# Altium schematic sheet Copy of Sheet1.SchDoc
size A3
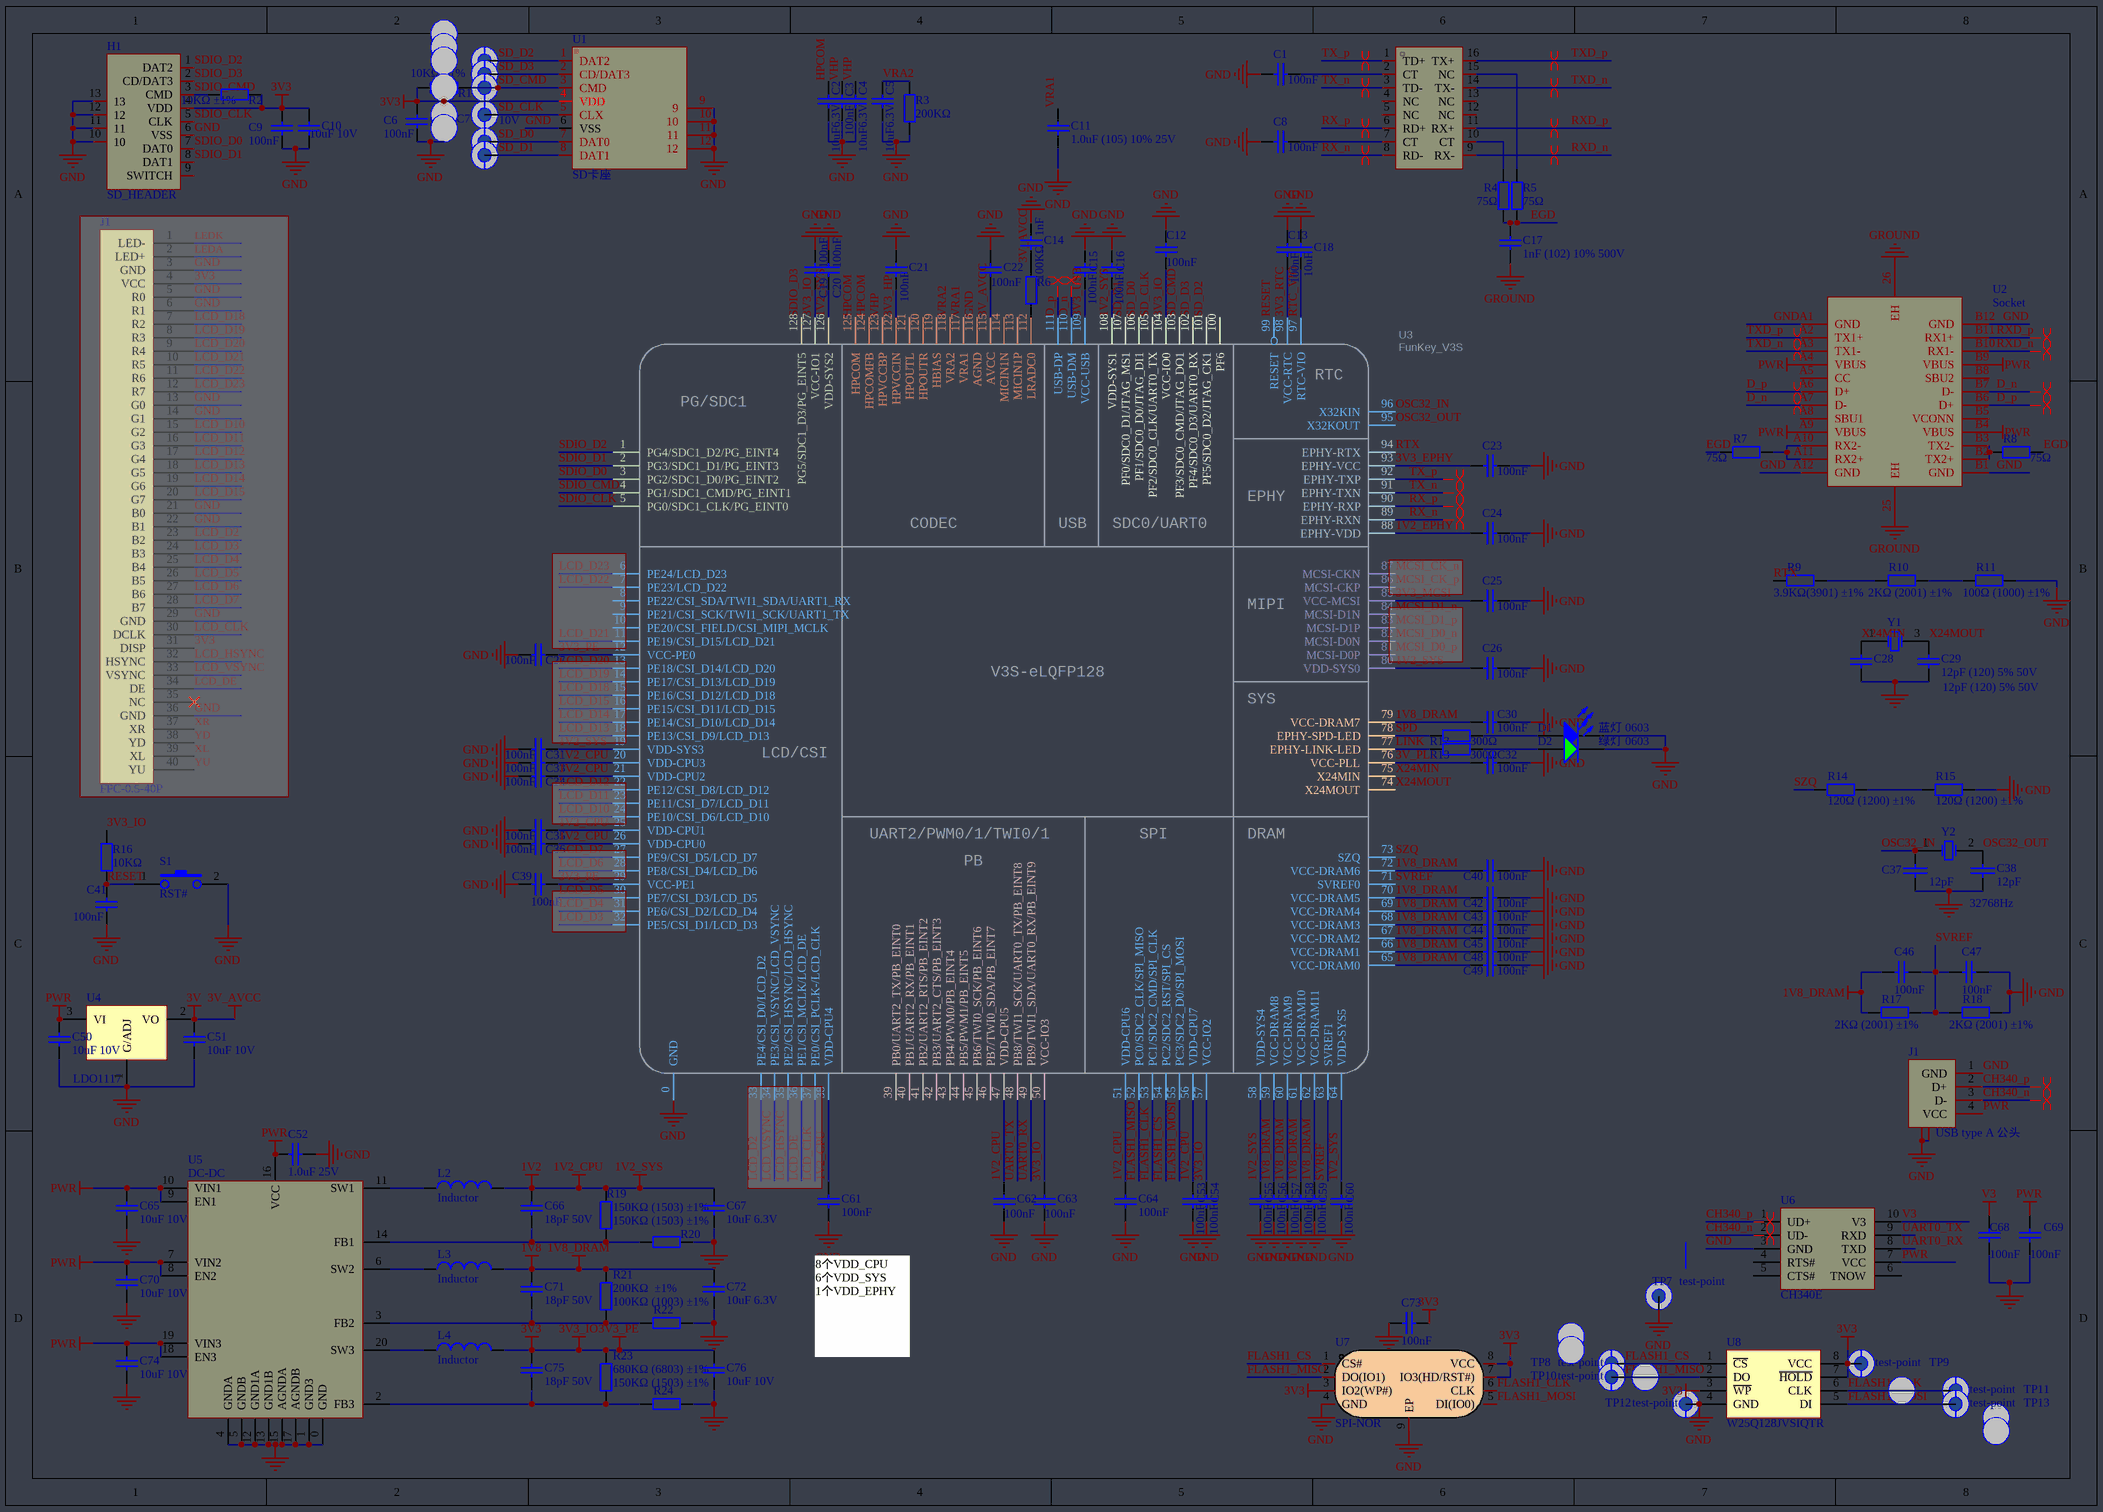
[diagram p0: Copy of Sheet1.SchDoc]

## Parts
(Parts that share a designator on the sheet are numbered #1, #2 ... from top to bottom, then left to right.)
C1  100nF  [0402_C]
C2  10uF6.3V  [0402_C]
C3  100nF  [0402_C]
C4  10uF6.3V  [0402_C]
C5  10uF6.3V  [0402_C]
C6  100nF  [0402_C]
C7  10uF 10V  [0603_C]
C8  100nF  [0402_C]
C9  100nF  [0402_C]
C10  10uF 10V  [0603_C]
C11  1.0uF (105) 10% 25V  [0402_C]
C12  100nF  [0402_C]
C13  100nF  [0402_C]
C14  1nF  [0402_C]
C15  100nF  [0402_C]
C16  100nF  [0402_C]
C17  1nF (102) 10% 500V  [1206_C]
C18  10uF  [0402_C]
C19  100nF  [0402_C]
C20  100nF  [0402_C]
C21  100nF  [0402_C]
C22  100nF  [0402_C]
C23  100nF  [0402_C]
C24  100nF  [0402_C]
C25  100nF  [0402_C]
C26  100nF  [0402_C]
C27  100nF  [0402_C]
C28  12pF (120) 5% 50V  [0402_C]
C29  12pF (120) 5% 50V  [0402_C]
C30  100nF  [0402_C]
C31  100nF  [0402_C]
C32  100nF  [0402_C]
C33  100nF  [0402_C]
C34  100nF  [0402_C]
C35  100nF  [0402_C]
C36  100nF  [0402_C]
C37  12pF  [0402_C]
C38  12pF  [0402_C]
C39  100nF  [0402_C]
C40  100nF  [0402_C]
C41  100nF  [0402_C]
C42  100nF  [0402_C]
C43  100nF  [0402_C]
C44  100nF  [0402_C]
C45  100nF  [0402_C]
C46  100nF  [0402_C]
C47  100nF  [0402_C]
C48  100nF  [0402_C]
C49  100nF  [0402_C]
C50  10uF 10V  [0603_C]
C51  10uF 10V  [0603_C]
C52  1.0uF 25V  [0402_C]
C53  100nF  [0402_C]
C54  100nF  [0402_C]
C55  100nF  [0402_C]
C56  100nF  [0402_C]
C57  100nF  [0402_C]
C58  100nF  [0402_C]
C59  100nF  [0402_C]
C60  100nF  [0402_C]
C61  100nF  [0402_C]
C62  100nF  [0402_C]
C63  100nF  [0402_C]
C64  100nF  [0402_C]
C65  10uF 10V  [0603_C]
C66  18pF 50V  [0402_C]
C67  10uF 6.3V  [0402_C]
C68  100nF  [0402_C]
C69  100nF  [0402_C]
C70  10uF 10V  [0603_C]
C71  18pF 50V  [0402_C]
C72  10uF 6.3V  [0402_C]
C73  100nF  [0402_C]
C74  10uF 10V  [0603_C]
C75  18pF 50V  [0402_C]
C76  10uF 10V  [0603_C]
D1  蓝灯 0603  [0603_LED_S1]
D2  绿灯 0603  [0603_LED_S1]
H1  SD_HEADER  [SD_HEADER]
J1#1  FPC-0.5-40P  [PFC40]  (masked out: inside a compile mask, not in the netlist)
J1#2  USB type A 公头  [USBAM]
L1  B1603S  [SOIC-16_L12.7-W7.1-P1.27-LS9.5-BL]  (value not drawn)
L2  Inductor  [0603_L]
L3  Inductor  [0603_L]
L4  Inductor  [0603_L]
R1  10KΩ ±1%  [0402_R]
R2  10KΩ ±1%  [0402_R]
R3  200KΩ  [0402_R]
R4  75Ω  [0402_R]
R5  75Ω  [0402_R]
R6  100KΩ  [0402_R]
R7  75Ω  [0402_R]
R8  75Ω  [0402_R]
R9  3.9KΩ(3901) ±1%  [0402_R]
R10  2KΩ (2001) ±1%  [0402_R]
R11  100Ω (1000) ±1%  [0402_R]
R12  300Ω  [0402_R]
R13  300Ω  [0402_R]
R14  120Ω (1200) ±1%  [0402_R]
R15  120Ω (1200) ±1%  [0402_R]
R16  10KΩ  [0402_R]
R17  2KΩ (2001) ±1%  [0402_R]
R18  2KΩ (2001) ±1%  [0402_R]
R19  150KΩ (1503) ±1%  [0402_R]
R20  150KΩ (1503) ±1%  [0402_R]
R21  200KΩ  ±1%  [0402_R]
R22  100KΩ (1003) ±1%  [0402_R]
R23  680KΩ (6803) ±1%  [0402_R]
R24  150KΩ (1503) ±1%  [0402_R]
S1  RST#  [SW-3*4-2P]
TP1  test-point  [POINT]  (value not drawn)
TP2  test-point  [POINT]  (value not drawn)
TP3  test-point  [POINT]  (value not drawn)
TP4  test-point  [POINT]  (value not drawn)
TP5  test-point  [POINT]  (value not drawn)
TP6  test-point  [POINT]  (value not drawn)
TP7  test-point  [POINT]
TP8  test-point  [POINT]
TP9  test-point  [POINT]
TP10  test-point  [POINT]
TP11  test-point  [POINT]
TP12  test-point  [POINT]
TP13  test-point  [POINT]
U1  SD卡座  [tf103]
U2  Socket  [USB type C 24 pin]
U3  FunKey_V3S  [ELQFP-128]
U4  LDO1117  [SOT-23-3L]
U5  DC-DC  [QFN20_3X3]
U6  CH340E  [MSOP10]
U7  SPI-NOR  [WSON8]
U8  W25Q128JVSIQTR  [SOIC-8_208mil]
Y1  25MHZ 12PF 10PPM  [SMD-3225_4P]  (value not drawn)
Y2  32768Hz  [3225-2]

## Nets
1V2_CPU: C16.2 C20.2 C26.2 C31.2 C33.2 C34.2 C35.2 C36.2 C53.2 C55.2 C60.2 C61.2 C62.2 C64.2 C66.2 C67.2 L2.2 R19.2 U3.19(VDD-SYS3) U3.20(VDD-CPU3) U3.21(VDD-CPU2) U3.25(VDD-CPU1) U3.26(VDD-CPU0) U3.38(VDD-CPU4) U3.47(VDD-CPU5) U3.51(VDD-CPU6) U3.56(VDD-CPU7) U3.58(VDD-SYS4) U3.64(VDD-SYS5) U3.80(VDD-SYS0) U3.108(VDD-SYS1) U3.126(VDD-SYS2)  [also labelled 1V2, 1V2_SYS]
1V8_DRAM: C30.2 C40.2 C42.2 C43.2 C44.2 C45.2 C46.2 C48.2 C49.2 C56.2 C57.2 C58.2 C59.2 C71.2 C72.2 L3.2 R17.1 R21.2 U3.59(VCC-DRAM8) U3.60(VCC-DRAM9) U3.61(VCC-DRAM10) U3.62(VCC-DRAM11) U3.65(VCC-DRAM0) U3.66(VCC-DRAM1) U3.67(VCC-DRAM2) U3.68(VCC-DRAM3) U3.69(VCC-DRAM4) U3.70(VCC-DRAM5) U3.72(VCC-DRAM6) U3.79(VCC-DRAM7)  [also labelled 1V8]
3V3_IO: C6.2 C7.2 C9.2 C10.2 C12.2 C19.2 C27.2 C39.2 C54.2 C63.2 C73.2 C75.2 C76.2 H1.4(VDD) L4.2 R1.2 R2.1 R16.2 R23.2 TP9.1(point) U1.4(VDD) U3.12(VCC-PE0) U3.29(VCC-PE1) U3.50(VCC-IO3) U3.57(VCC-IO2) U3.104(VCC-IO0) U3.127(VCC-IO1) U7.3(IO2(WP#)) U7.7(IO3(HD/RST#)) U7.8(VCC) U8.3(~{WP}) U8.7(~{HOLD}) U8.8(VCC)  [also labelled 3V3, 3V3_PE]
3V_AVCC: C14.1 C22.2 C51.2 R6.2 U3.115(AVCC) U4.2(VO)  [also labelled 3V]
GND: C1.2 C2.1 C3.2 C4.1 C5.1 C6.1 C7.1 C8.2 C9.1 C10.1 C11.1 C12.1 C13.1 C14.2 C15.1 C16.1 C18.2 C19.1 C20.1 C21.1 C22.1 C23.1 C24.1 C25.1 C26.1 C27.1 C28.1 C29.1 C30.1 C31.1 C32.1 C33.1 C34.1 C35.1 C36.1 C37.1 C38.1 C39.1 C40.1 C41.1 C42.1 C43.1 C44.1 C45.1 C47.1 C48.1 C49.1 C50.1 C51.1 C52.1 C53.1 C54.1 C55.1 C56.1 C57.1 C58.1 C59.1 C60.1 C61.1 C62.1 C63.1 C64.1 C65.1 C67.1 C68.1 C69.1 C70.1 C72.1 C73.1 C74.1 C76.1 D1.K D2.K H1.6(VSS) H1.10 H1.11 H1.12 H1.13 J1#2.1(GND) J1#2.5 J1#2.6 R3.1 R11.2 R15.2 R18.2 R20.1 R22.2 R24.2 S1.2 TP7.1(point) TP12.1(point) U1.6(VSS) U1.9 U1.10 U1.11 U1.12 U2.A1(GND) U2.A12(GND) U2.B1(GND) U2.B12(GND) U3.0(GND) U3.116(AGND) U4.1(G/ADJ) U5.0(GND) U5.1(GND3) U5.4(GNDA) U5.5(GNDB) U5.12(GND1A) U5.13(GND1B) U5.15(AGNDA) U5.17(AGNDB) U6.3(GND) U7.4(GND) U7.9(EP) U8.4(GND)
GROUND: C17.1 U2.25(EH) U2.26(EH)
PWR: C50.2 C52.2 C65.2 C69.2 C70.2 C74.2 J1#2.4(VCC) U2.A4(VBUS) U2.A9(VBUS) U2.B4(VBUS) U2.B9(VBUS) U4.3(VI) U5.7(VIN2) U5.8(EN2) U5.9(EN1) U5.10(VIN1) U5.16(VCC) U5.18(EN3) U5.19(VIN3) U6.7(VCC)
V3: C68.2 U6.10(V3)
1V2_EPHY: C24.2 U3.88(EPHY-VDD)
3V3_EPHY: C23.2 U3.93(EPHY-VCC)
3V3_HP: C21.2 U3.122(HPVCCIN)
3V3_MCSI: C25.2 U3.85(VCC-MCSI)
3V3_RTC: C13.2 U3.98(VCC-RTC)
3V3_USB: C15.2 U3.109(VCC-USB)
3V_PLL: C32.2 U3.76(VCC-PLL)
CH340_n: J1#2.3(D-) U6.2(UD-)
CH340_p: J1#2.2(D+) U6.1(UD+)
D_n: U2.A7(D-) U2.B7(D-) U3.110(USB-DM)
D_p: U2.A6(D+) U2.B6(D+) U3.111(USB-DP)
EGD: C17.2 R4.1 R5.1 R7.2 R8.2
FLASH1_CLK: TP11.1(point) U3.53(PC1/SDC2_CMD/SPI_CLK) U7.6(CLK) U8.6(CLK)
FLASH1_CS: TP8.1(point) U3.54(PC2/SDC2_RST/SPI_CS) U7.1(CS#) U8.1(~{CS})
FLASH1_MISO: TP10.1(point) U3.52(PC0/SDC2_CLK/SPI_MISO) U7.2(DO(IO1)) U8.2(DO)
FLASH1_MOSI: TP13.1(point) U3.55(PC3/SDC2_D0/SPI_MOSI) U7.5(DI(IO0)) U8.5(DI)
HPCOM: C2.2 U3.124(HPCOMFB) U3.125(HPCOM)
LINK: R13.1 U3.77(EPHY-LINK-LED)
OSC32_IN: C37.2 U3.96(X32KIN) Y2.1(OSC1)
OSC32_OUT: C38.2 U3.95(X32KOUT) Y2.2(OSC2)
RESET: C41.2 R16.1 S1.1 U3.99(RESET)
RTC_VIO: C18.1 U3.97(RTC-VIO)
RTX: R9.1 U3.94(EPHY-RTX)
RX_n: L1.8(RD-) U3.89(EPHY-RXN)
RX_p: L1.6(RD+) U3.90(EPHY-RXP)
RXD_n: L1.9(RX-) U2.B10(RX1-)
RXD_p: L1.11(RX+) U2.B11(RX1+)
SD_CLK: TP4.1(point) U1.5(CLX) U3.105(PF2/SDC0_CLK/UART0_TX)
SD_CMD: R1.1 TP3.1(point) U1.3(CMD) U3.103(PF3/SDC0_CMD/JTAG_DO1)
SD_D0: TP5.1(point) U1.7(DAT0) U3.106(PF1/SDC0_D0/JTAG_DI1)
SD_D1: TP6.1(point) U1.8(DAT1) U3.107(PF0/SDC0_D1/JTAG_MS1)
SD_D2: TP1.1(point) U1.1(DAT2) U3.101(PF5/SDC0_D2/JTAG_CK1)
SD_D3: TP2.1(point) U1.2(CD/DAT3) U3.102(PF4/SDC0_D3/UART0_RX)
SDIO_CLK: H1.5(CLK) U3.5(PG0/SDC1_CLK/PG_EINT0)
SDIO_CMD: H1.3(CMD) R2.2 U3.4(PG1/SDC1_CMD/PG_EINT1)
SDIO_D0: H1.7(DAT0) U3.3(PG2/SDC1_D0/PG_EINT2)
SDIO_D1: H1.8(DAT1) U3.2(PG3/SDC1_D1/PG_EINT3)
SDIO_D2: H1.1(DAT2) U3.1(PG4/SDC1_D2/PG_EINT4)
SDIO_D3: H1.2(CD/DAT3) U3.128(PG5/SDC1_D3/PG_EINT5)
SPD: R12.1 U3.78(EPHY-SPD-LED)
SVREF: C46.1 C47.2 R17.2 R18.1 U3.63(SVREF1) U3.71(SVREF0)
SZQ: R14.1 U3.73(SZQ)
TX_n: L1.3(TD-) U3.91(EPHY-TXN)
TX_p: L1.1(TD+) U3.92(EPHY-TXP)
TXD_n: L1.14(TX-) U2.A3(TX1-)
TXD_p: L1.16(TX+) U2.A2(TX1+)
UART0_RX: U3.49(PB9/TWI1_SDA/UART0_RX/PB_EINT9) U6.8(TXD)
UART0_TX: U3.48(PB8/TWI1_SCK/UART0_TX/PB_EINT8) U6.9(RXD)
VHP: C3.1 C4.2 U3.123(HPVCCBP)
VRA1: C11.2 U3.117(VRA1)
VRA2: C5.2 R3.2 U3.118(VRA2)
X24MIN: C28.2 U3.75(X24MIN) Y1.1(OSC1)
X24MOUT: C29.2 U3.74(X24MOUT) Y1.3(OSC2)
NetC1_1: C1.1 L1.2(CT)
NetC8_1: C8.1 L1.7(CT)
NetC66_1: C66.1 R19.1 R20.2 U5.14(FB1)
NetC71_1: C71.1 R21.1 R22.1 U5.3(FB2)
NetC75_1: C75.1 R23.1 R24.1 U5.2(FB3)
NetD1_A: D1.A R12.2
NetD2_A: D2.A R13.2
NetL1_10: L1.10(CT) R4.2
NetL1_15: L1.15(NC) R5.2
NetL2_1: L2.1 U5.11(SW1)
NetL3_1: L3.1 U5.6(SW2)
NetL4_1: L4.1 U5.20(SW3)
NetR6_1: R6.1 U3.112(LRADC0)
NetR7_1: R7.1 U2.A10(RX2-) U2.A11(RX2+)
NetR8_1: R8.1 U2.B2(TX2+) U2.B3(TX2-)
NetR9_2: R9.2 R10.1
NetR10_2: R10.2 R11.1
NetR14_2: R14.2 R15.1

Not connected (* = marked no-connect by the designer): H1 9(SWITCH); L1 4(NC) 5(NC) 12(NC) 13(NC); U2 A5(CC) A8(SBU1) B5(VCONN) B8(SBU2); U3 6(PE24/LCD_D23) 7(PE23/LCD_D22) 8(PE22/CSI_SDA/TWI1_SDA/UART1_RX) 9(PE21/CSI_SCK/TWI1_SCK/UART1_TX) 10(PE20/CSI_FIELD/CSI_MIPI_MCLK) 11(PE19/CSI_D15/LCD_D21) 13(PE18/CSI_D14/LCD_D20) 14(PE17/CSI_D13/LCD_D19) 15(PE16/CSI_D12/LCD_D18) 16(PE15/CSI_D11/LCD_D15) 17(PE14/CSI_D10/LCD_D14) 18(PE13/CSI_D9/LCD_D13) 22(PE12/CSI_D8/LCD_D12) 23(PE11/CSI_D7/LCD_D11) 24(PE10/CSI_D6/LCD_D10) 27(PE9/CSI_D5/LCD_D7) 28(PE8/CSI_D4/LCD_D6) 30(PE7/CSI_D3/LCD_D5) 31(PE6/CSI_D2/LCD_D4) 32(PE5/CSI_D1/LCD_D3) 33(PE4/CSI_D0/LCD_D2) 34(PE3/CSI_VSYNC/LCD_VSYNC) 35(PE2/CSI_HSYNC/LCD_HSYNC) 36(PE1/CSI_MCLK/LCD_DE) 37(PE0/CSI_PCLK-/LCD_CLK) 39(PB0/UART2_TX/PB_EINT0) 40(PB1/UART2_RX/PB_EINT1) 41(PB2/UART2_RTS/PB_EINT2) 42(PB3/UART2_CTS/PB_EINT3) 43(PB4/PWM0/PB_EINT4) 44(PB5/PWM1/PB_EINT5) 45(PB6/TWI0_SCK/PB_EINT6) 46(PB7/TWI0_SDA/PB_EINT7) 81(MCSI-D0P) 82(MCSI-D0N) 83(MCSI-D1P) 84(MCSI-D1N) 86(MCSI-CKP) 87(MCSI-CKN) 100(PF6) 113(MICIN1P) 114(MICIN1N) 119(HBIAS) 120(HPOUTR) 121(HPOUTL); U6 4(RTS#) 5(CTS#) 6(TNOW)

## Layout directives
differential pair: CH340_n, CH340_p, D_n, D_p, RX_n, RX_p, RXD_n, RXD_p, TX_n, TX_p, TXD_n, TXD_p

## Notes on the sheet
- (near C61) 8个VDD_CPU
  6个VDD_SYS
  1个VDD_EPHY
- (in symbol FunKey_V3S) RTC; PG/SDC1; EPHY; CODEC; USB; SDC0/UART0; MIPI; V3S-eLQFP128; SYS; LCD/CSI; UART2/PWM0/1/TWI0/1; SPI; DRAM; PB

## Library data of the parts
C1 C3 C6 C8 C9 C12 C13 C15 C16 C19-C27 C30-C36 C39 C40 C42-C49 C53-C64 C68 C69 C73 = 0603 100nF (104) 10% 50V: 贴片电容; ComponentLink1Description: 供应商链接; ComponentLink1URL: http://www.szlcsc.com/product/details_15331.html; Package: 0603; Supplier: LC; SuppliersPartNumber: C14663
C2 C4 C5 C18 C67 C72 = 0402 10uF (106) 20% 6.3V: 贴片电容; ComponentLink1Description: 供应商链接; ComponentLink1URL: http://www.szlcsc.com/product/details_16204.html; Package: 0402; Supplier: LC; SuppliersPartNumber: C15525
C7 C10 C50 C51 C65 C70 C74 C76 = 0603 10uF (106) 10% 10V: 贴片电容; ComponentLink1Description: 供应商链接; ComponentLink1URL: http://www.szlcsc.com/product/details_20411.html; Package: 0603; Supplier: LC; SuppliersPartNumber: C19702
C11 C52 = 0402 1.0uF (105) 10% 25V: 贴片电容; ComponentLink1Description: 供应商链接; ComponentLink1URL: http://www.szlcsc.com/product/details_53938.html; Package: 0402; Supplier: LC; SuppliersPartNumber: C52923
C14 = 0402 1nF (102) 10% 50V: 贴片电容; ComponentLink1Description: 供应商链接; ComponentLink1URL: http://www.szlcsc.com/product/details_1875.html; Package: 0402; Supplier: LC; SuppliersPartNumber: C1523
C17 = 1206 1nF (102) 10% 500V: 贴片电容; ComponentLink1Description: 供应商链接; ComponentLink1URL: http://www.szlcsc.com/product/details_36187.html; Package: 1206; Supplier: LC; SuppliersPartNumber: C35216
C28 C29 = 0603 12pF (120) 5% 50V: 贴片电容; ComponentLink1Description: 供应商链接; ComponentLink1URL: http://www.szlcsc.com/product/details_39506.html; Package: 0603; Supplier: LC; SuppliersPartNumber: C38523
C37 C38 = CAP: Capacitor
C41 = 0402 100nF (104) 10% 16V: 贴片电容; ComponentLink1Description: 供应商链接; ComponentLink1URL: http://www.szlcsc.com/product/details_1877.html; Package: 0402; Supplier: LC; SuppliersPartNumber: C1525
C66 C71 C75 = 0402 18pF (180) 5% 50V: 贴片电容; ComponentLink1Description: 供应商链接; ComponentLink1URL: http://www.szlcsc.com/product/details_1901.html; Package: 0402; Supplier: LC; SuppliersPartNumber: C1549
D1 = 0603 蓝灯: 发光二极管; ComponentLink1Description: 供应商链接; ComponentLink1URL: http://www.szlcsc.com/product/details_73150.html; Package: 0603; Supplier: LC; SuppliersPartNumber: C72041
D2 = 0603 绿灯: 发光二极管; ComponentLink1Description: 供应商链接; ComponentLink1URL: http://www.szlcsc.com/product/details_73152.html; Package: 0603; Supplier: LC; SuppliersPartNumber: C72043
H1 = SD_HEADER: 贴片单插式SD卡
J1#1 = FW050TFT-V03: LCD排线接口 上接
J1#2 = C42605 母座贴片: 货号对应
L1 = B1603S: Manufacturer: CND-tek(磁联达); Add into BOM: yes; Name: B1603S; Symbol: B1603S; Device: B1603S; LCSC Part Name: 单口百兆网络隔离变压器; Supplier Part: C3003215; Manufacturer Part: B1603S; Supplier Footprint: SOIC-16-7.1mm; JLCPCB Part Class: Extended Part; Datasheet: https://atta.szlcsc.com/upload/public/pdf/source/20220621/E46676EAD779E5D7558DAB86D017A6AD.pdf; Supplier: LCSC; Convert to PCB: yes
L2-L4 = Inductor: Code_IEC: 1005; Value: 10mH; Published: 8-Jun-2000; LatestRevisionDate: 29-May-2009; LatestRevisionNote: IPC-7351 Footprint Added.; PackageReference: 0402-A; Publisher: Altium Limited; PackageDescription: Chip Inductor; Code_JEITA: 0402
R1 R2 R16 = 0402 10KΩ (1002) 1%: 贴片电阻; ComponentLink1Description: 供应商链接; ComponentLink1URL: http://www.szlcsc.com/product/details_26487.html; Package: 0402; Supplier: LC; SuppliersPartNumber: C25744
R3 R21 = 0402 200KΩ (2003) 1%: 贴片电阻; ComponentLink1Description: 供应商链接; ComponentLink1URL: http://www.szlcsc.com/product/details_26507.html; Package: 0402; Supplier: LC; SuppliersPartNumber: C25764
R4 R5 R7 R8 = 0402 75Ω (75R0) 1%: 贴片电阻; ComponentLink1Description: 供应商链接; ComponentLink1URL: http://www.szlcsc.com/product/details_25876.html; Package: 0402; Supplier: LC; SuppliersPartNumber: C25133
R6 R22 = 0402 100KΩ (1003) 1%: 贴片电阻; ComponentLink1Description: 供应商链接; ComponentLink1URL: http://www.szlcsc.com/product/details_26484.html; Package: 0402; Supplier: LC; SuppliersPartNumber: C25741
R9 = 0402 3.9KΩ(3901) 1%: 贴片电阻; ComponentLink1Description: 供应商链接; ComponentLink1URL: http://www.szlcsc.com/product/details_52734.html; Package: 0402; Supplier: LC; SuppliersPartNumber: C51721
R10 R17 R18 = 0402 2KΩ (2001) 1%: 贴片电阻; ComponentLink1Description: 供应商链接; ComponentLink1URL: http://www.szlcsc.com/product/details_4516.html; Package: 0402; Supplier: LC; SuppliersPartNumber: C4109
R11 = 0402 100Ω (1000) 1%: 贴片电阻; ComponentLink1Description: 供应商链接; ComponentLink1URL: http://www.szlcsc.com/product/details_25819.html; Package: 0402; Supplier: LC; SuppliersPartNumber: C25076
R12 R13 = 0402 300Ω (3000) 1%: 贴片电阻; ComponentLink1Description: 供应商链接; ComponentLink1URL: http://www.szlcsc.com/product/details_25845.html; Package: 0402; Supplier: LC; SuppliersPartNumber: C25102
R14 R15 = 0402 120Ω (1200) 1%: 贴片电阻; ComponentLink1Description: 供应商链接; ComponentLink1URL: http://www.szlcsc.com/product/details_25822.html; Package: 0402; Supplier: LC; SuppliersPartNumber: C25079
R19 R20 R24 = 0402 150KΩ (1503) 1%: 贴片电阻; ComponentLink1Description: 供应商链接; ComponentLink1URL: http://www.szlcsc.com/product/details_26498.html; Package: 0402; Supplier: LC; SuppliersPartNumber: C25755
R23 = 0603 680KΩ (6803) 1%: 贴片电阻; ComponentLink1Description: 供应商链接; ComponentLink1URL: http://www.szlcsc.com/product/details_26565.html; Package: 0603; Supplier: LC; SuppliersPartNumber: C25822
S1 = KEY1
TP1-TP13 = test-point: 测试点
U1 = TF103
U2 = USB type C 沉板公头: pin to pad: 25>0 26>0
U3 = FunKey_V3S: Contributor: mlpzaq9998; spicePre: U; spiceSymbolName: FunKey_V3S
U4 = LDO1117: LDO
U5 = RY1303A: 3CH-DCDC
U6 = CH340E: USB TO UART TTL
U7 = W25Q64: NOR FLASH
U8 = W25Q128JVSIQTR_[C97521]: Flash ROM; ComponentLink1Description: 供应商链接; ComponentLink1URL: https://item.szlcsc.com/98729.html; Package: SOIC-8; Supplier: LC; SuppliersPartNumber: C97521
Y1 = SMD-3225_4P  25MHZ 12PF 10PPM: 贴片晶振; ComponentLink1Description: 供应商链接; ComponentLink1URL: http://www.szlcsc.com/product/details_9526.html; Package: SMD-3225_4P; Supplier: LC; SuppliersPartNumber: C9006
Y2 = XTAL: Crystal Oscillator; Published: 8-Jun-2000; LatestRevisionDate: 17-Jul-2002; LatestRevisionNote: Re-released for DXP Platform.; PackageReference: R38; Publisher: Altium Limited; PackageDescription: Crystal, Thru-Hole; 2 Leads; Body 3.1 x 8.2 mm (Dia.xH)